# Altium schematic sheet Power.SchDoc
size A4; SheetNumber: 4; SheetTotal: 9
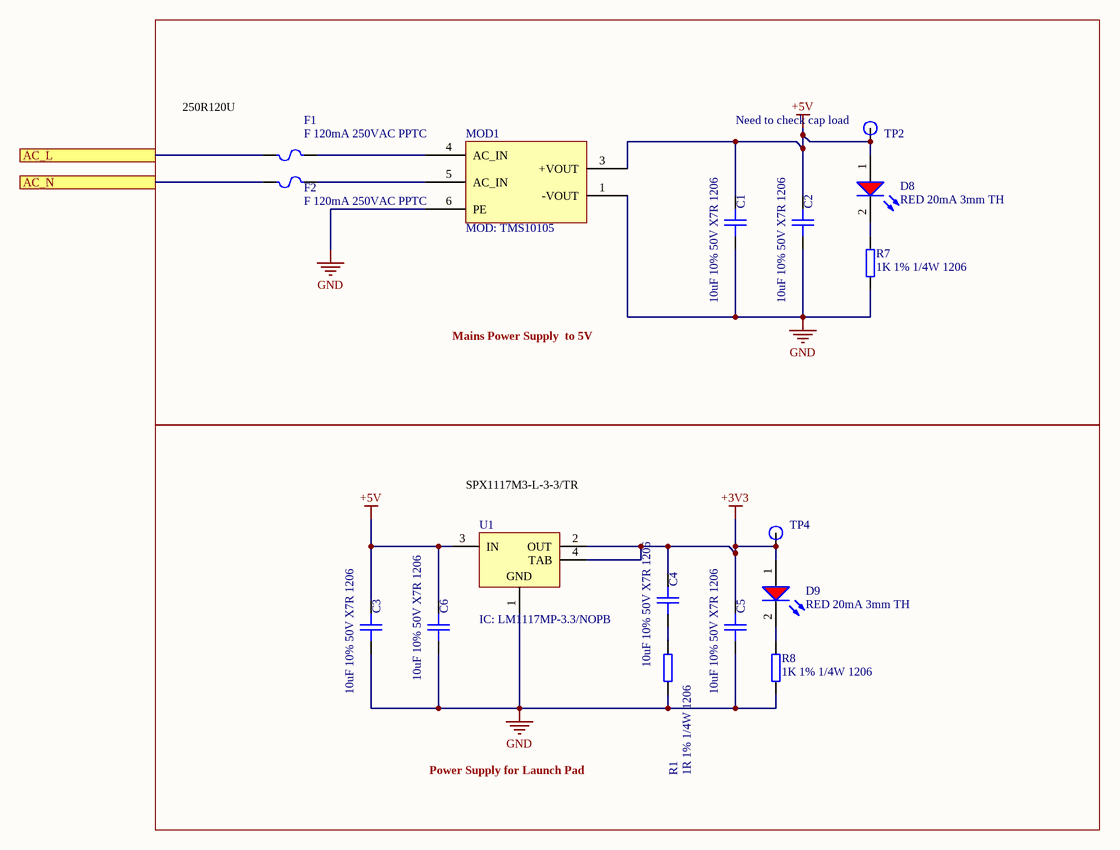
[diagram p0: Power.SchDoc]

## Parts
C1  10uF 10% 50V X7R 1206  [CAPC3216X18N]
C2  10uF 10% 50V X7R 1206  [CAPC3216X18N]
C3  10uF 10% 50V X7R 1206  [CAPC3216X18N]
C4  10uF 10% 50V X7R 1206  [CAPC3216X18N]
C5  10uF 10% 50V X7R 1206  [CAPC3216X18N]
C6  10uF 10% 50V X7R 1206  [CAPC3216X18N]
D8  RED 20mA 3mm TH  [WL-TMRC_D3.95H5.3]
D9  RED 20mA 3mm TH  [WL-TMRC_D3.95H5.3]
F1  F 120mA 250VAC PPTC  [New footprint 1]
F2  F 120mA 250VAC PPTC  [New footprint 1]
MOD1  MOD: TMS10105  [MOD: TMS10105-Footprint-1]
R1  1R 1% 1/4W 1206  [RESC3116X06N]
R7  1K 1% 1/4W 1206  [RESC3116X06N]
R8  1K 1% 1/4W 1206  [RESC3116X06N]
TP2  TestPoint  [Test Point-Footprint-1]  (value not drawn)
TP4  TestPoint  [Test Point-Footprint-1]  (value not drawn)
U1  IC: LM1117MP-3.3/NOPB  [DCY0004A_M]

## Blocks framed on the sheet
Power Supply for Launch Pad: C3-C6 D9 R1 R8 TP4 U1

## Ports
AC_L (see Control_Board_SCH[1A]), AC_N (see Control_Board_SCH[1A])

## Nets
+3V3: C4.2 C5.2 D9.1(A) TP4.1 U1.2(OUT) U1.4(TAB)
+5V: C1.2 C2.2 C3.2 C6.2 D8.1(A) MOD1.3(+VOUT) TP2.1 U1.3(IN)
GND: C1.1 C2.1 C3.1 C5.1 C6.1 MOD1.1(-VOUT) MOD1.6(PE) R1.1 R7.1 R8.1 U1.1(GND)
AC_L: F1.1 ; port AC_L
AC_N: F2.1 ; port AC_N
NetC4_1: C4.1 R1.2
NetD8_2: D8.2(K) R7.2
NetD9_2: D9.2(K) R8.2
NetF1_2: F1.2 MOD1.4(AC_IN)
NetF2_2: F2.2 MOD1.5(AC_IN)

## Notes on the sheet
- 250R120U
- (near TP2) Need to check cap load
- Mains Power Supply  to 5V
- SPX1117M3-L-3-3/TR

## Library data of the parts
C1-C6 = CMP-001-00049-1: Ceramic Capacitor, Multilayer, Ceramic, 50V, 10% +Tol, 10% -Tol, X7R, 15% TC, 10uF, Surface Mount, 1206; Manufacturer Part Number: C3216X7R1H106K160AC; Manufacturer: TDK; Manufacturer Lifecycle Status: PRODUCTION; Value: 10µF; ComponentLink3Description: https://datasheet.octopart.com:443/C3216X7R1H106K160AC-TDK-datasheet-159617022.pdf?src-supplier=TME; ComponentLink3URL: https://datasheet.octopart.com:443/C3216X7R1H106K160AC-TDK-datasheet-159617022.pdf?src-supplier=TME; China RoHS: Compliant; Case Code (Metric): 3216; ComponentLink2URL: https://datasheet.octopart.com:443/C3216X7R1H106K160AC-TDK-datasheet-182135025.pdf?src-supplier=TME; Mounting Technology: Surface Mount; Dielectric: X7R; Material: Ceramic; RoHS: Compliant; Introduction Date: 2018-03-29; Design Item ID: 10uF 10% 50V X7R 1206; Max Length: 3.5mm; ComponentLink4URL: https://datasheet.octopart.com:443/C3216X7R1H106K160AC-TDK-datasheet-151546523.pdf?src-supplier=ODG+(Origin+Data+Global); Length: 3.2mm; Height: 1.6mm; Harmonized Tariff Schedule (HTS) Code: 8532.24.00.20; Lifecycle Status: Production; ComponentLink1Description: https://datasheet.octopart.com:443/C3216X7R1H106K160AC-TDK-datasheet-175423548.pdf?src-supplier=TME; Width: 1.6mm; Min Length: 3.1mm; Min Operating Temperature: -55°C; Number of Terminals: 2; ComponentLink4Description: https://datasheet.octopart.com:443/C3216X7R1H106K160AC-TDK-datasheet-151546523.pdf?src-supplier=ODG+(Origin+Data+Global); Dielectric Material: Ceramic; Source: MasterLibrary_SCH.SchLib; Lead Free: Lead Free; Category: Ceramic Capacitors; ComponentLink5URL: https://datasheet.octopart.com/C3216X7R1H106K160AC-TDK-datasheet-41194876.pdf; ComponentLink5Description: https://datasheet.octopart.com/C3216X7R1H106K160AC-TDK-datasheet-41194876.pdf; Schedule B: 8532240020, 8532240020; Case/Package: 1206; Max Width: 1.9mm; Stock: 26276; Min Width: 1.5mm; Thickness: 1.6mm; ComponentLink1URL: https://datasheet.octopart.com:443/C3216X7R1H106K160AC-TDK-datasheet-175423548.pdf?src-supplier=TME; Pricing: 100=3,09, 250=2,81, 500=2,35, 1000=2,2, 2000=1,97 (DKK); Max Operating Temperature: 125°C; ComponentLink2Description: https://datasheet.octopart.com:443/C3216X7R1H106K160AC-TDK-datasheet-182135025.pdf?src-supplier=TME; Voltage Rating: 50V; REACH SVHC: Yes; Voltage Rating (DC): 50V; Export Control Classification Number (ECCN) Code: EAR99
D8 D9 = CMP-007-00005-2: LED RED DIFFUSED 3MM ROUND T/H; Manufacturer: Wurth Elektronik; Manufacturer Part Number: 151031SS06000; Lens Style: Circular, Diffused, Round; Peak Wavelength: 650nm; Dominant Wavelength: 640nm; Max Reverse Voltage (DC): 5V; Luminous Intensity: 35mcd; Forward Voltage: 2.2V; Forward Current: 100mA; Max Operating Temperature: 85°C; Length: 3mm; Category: LEDs; RoHS: Compliant; Lens Size: 3mm; Height: 5.3mm; Test Current: 20mA; Color: Red; Min Operating Temperature: -40°C; Packaging: Bulk; Case/Package: Radial; Mount: Through Hole; REACH SVHC: Unknown
F1 F2 = CMP-005-00003-1: Polymeric PTC Resettable Fuse 60V (250V Int) 120 mA Ih Through Hole Radial, Disc; Manufacturer Part Number: 250R120U; Manufacturer: Littelfuse; Approvals: TUV, cULus; Current Rating: 3A; Harmonized Tariff Schedule (HTS) Code: 8533.40.80.70; Length: 11mm; Max Voltage Rating (DC): 60V; Lead Pitch: 5.1mm; Lead Free: Lead Free; China RoHS: Compliant; Introduction Date: 2006-06-05; Max Operating Temperature: 85°C; Lifecycle Status: Production; Max Current Rating: 3A; Hold Current: 120mA; Category: PTC Resettable Fuses; Height: 11mm; Case/Package: Radial; Export Control Classification Number (ECCN) Code: EAR99
MOD1 = CMP-019-00012-2: AC-DC Regulated Power Supply Module, 1 Output, 10W, 5V Output Hybrid; Manufacturer: Traco Power; Max Output Current: 2A; Approvals: CB, CE, EN, IEC, UL, cUL; Max Output Voltage: 5.1V; Efficiency: 78%; Min Output Voltage: 4.9V; Nominal Input Voltage: 115V; Min Input Voltage: 85V; Number of Outputs: 1; Max Input Voltage: 264V; Min Operating Temperature: -25°C; Max Output Power: 10W; Number of Pins: 6; Height - Seated (Max): 24.5mm; Max Operating Temperature: 60°C; Output Current: 2A; Number of Terminals: 6; Length: 55mm; Category: Power Supply Modules; Output Voltage: 5V; Depth: 45mm; Lifecycle Status: Obsolete; Manufacturer Part Number: TMS10105; Output Power: 10W; Nominal Output Voltage: 5V; Current - Output 1: 2A; Number of Circuits: 1
R1 = CMP-009-00657-1: Res Thick Film 1206 1 Ohm 1% 0.25W(1/4W) ±100ppm/C Pad SMD T/R Automotive AEC-Q200; Manufacturer: Stackpole Electronics; Manufacturer Part Number: RMCF1206FT1R00; Temperature Coefficient: 100ppm/°C; Max Power Dissipation: 125mW; Working Voltage: 150V; Value: 1; ComponentLink29URL: https://datasheet.octopart.com:443/RMCF1206FT10K0-Stackpole-Electronics-datasheet-8324226.pdf?src-supplier=Future+Electronics; ComponentLink11URL: https://datasheet.octopart.com:443/RMCF0805FT10K0-Stackpole-Electronics-datasheet-8359789.pdf?src-supplier=Future+Electronics; ComponentLink1Description: https://datasheet.octopart.com:443/RMCF0805FT10K0-Stackpole-Electronics-datasheet-182148065.pdf?src-supplier=IHS; ComponentLink16URL: http://sigma.octopart.com:80/141158211/reach_statement/Stackpole-Electronics-RMCF0805FT10K0.pdf?src-supplier=Compliance+Statements; ComponentLink16Description: http://sigma.octopart.com:80/141158211/reach_statement/Stackpole-Electronics-RMCF0805FT10K0.pdf?src-supplier=Compliance+Statements; Max Operating Temperature: 155°C; ComponentLink27Description: https://datasheet.octopart.com:443/RMCF1206FT10K0-Stackpole-Electronics-datasheet-11547379.pdf?src-supplier=Future+Electronics; ComponentLink19URL: https://datasheet.octopart.com:443/RMCF1206FT10K0-Stackpole-Electronics-datasheet-141193804.pdf?src-supplier=Master+Electronics; Number of Terminals: 2; ComponentLink31URL: http://sigma.octopart.com:80/141158212/rohs_statement/Stackpole-Electronics-RMCF1206FT10K0.pdf?src-supplier=Compliance+Statements; ComponentLink32Description: http://sigma.octopart.com:80/141158211/reach_statement/Stackpole-Electronics-RMCF1206FT10K0.pdf?src-supplier=Compliance+Statements; ComponentLink20Description: https://datasheet.octopart.com:443/RMCF1206FT10K0-Stackpole-Electronics-datasheet-189104163.pdf?src-supplier=Master+Electronics; ComponentLink7URL: https://datasheet.octopart.com:443/RMCF0805FT10K0-Stackpole-Electronics-datasheet-10788263.pdf?src-supplier=Stackpole+Electronics; ComponentLink4Description: https://datasheet.octopart.com:443/RMCF0805FT10K0-Stackpole-Electronics-datasheet-12510902.pdf?src-supplier=Upverter; ComponentLink21URL: https://datasheet.octopart.com:443/RMCF1206FT10K0-Stackpole-Electronics-datasheet-116606903.pdf?src-supplier=Master+Electronics; ComponentLink27URL: https://datasheet.octopart.com:443/RMCF1206FT10K0-Stackpole-Electronics-datasheet-11547379.pdf?src-supplier=Future+Electronics; ComponentLink10URL: https://datasheet.octopart.com:443/RMCF0805FT10K0-Stackpole-Electronics-datasheet-11547379.pdf?src-supplier=Future+Electronics; ComponentLink8URL: https://datasheet.octopart.com:443/RMCF0805FT10K0-Stackpole-Electronics-datasheet-154799224.pdf?src-supplier=Master+Electronics; Stock: 3420000; Features: Automotive AEC-Q200; Lifecycle Status: Production; Tolerance: 1%; ComponentLink15Description: http://sigma.octopart.com:80/15940719/materials_sheet/Stackpole-Electronics-RMCF0805FT10K0.pdf?src-supplier=Compliance+Statements; ComponentLink12Description: https://datasheet.octopart.com:443/RMCF0805FT10K0-Stackpole-Electronics-datasheet-8324226.pdf?src-supplier=Future+Electronics; ComponentLink18Description: https://datasheet.octopart.com:443/RMCF1206FT10K0-Stackpole-Electronics-datasheet-182148065.pdf?src-supplier=IHS; ComponentLink9URL: https://datasheet.octopart.com:443/RMCF0805FT10K0-Stackpole-Electronics-datasheet-11546843.pdf?src-supplier=Arrow+Electronics; Schedule B: 8533210045, 8533210045; Pricing: 5000=0.00245, 10000=0.00241, 20000=0.00238, 40000=0.00234, 80000=0.0023 (USD); ComponentLink5URL: https://datasheet.octopart.com:443/RMCF0805FT10K0-Stackpole-Electronics-datasheet-141193804.pdf?src-supplier=Stackpole+Electronics; ComponentLink31Description: http://sigma.octopart.com:80/141158212/rohs_statement/Stackpole-Electronics-RMCF1206FT10K0.pdf?src-supplier=Compliance+Statements; Case/Package: 1206; ComponentLink24URL: https://datasheet.octopart.com:443/RMCF1206FT10K0-Stackpole-Electronics-datasheet-12534581.pdf?src-supplier=Stackpole+Electronics; ComponentLink13Description: https://datasheet.octopart.com:443/RMCF0805FT10K0-Stackpole-Electronics-datasheet-8088878.pdf?src-supplier=Future+Electronics; ComponentLink2Description: https://datasheet.octopart.com:443/RMCF0805FT10K0-Stackpole-Electronics-datasheet-12534581.pdf?src-supplier=Upverter; ComponentLink17URL: http://sigma.octopart.com:80/141158212/rohs_statement/Stackpole-Electronics-RMCF0805FT10K0.pdf?src-supplier=Compliance+Statements; Depth: 1.25mm; ComponentLink3URL: https://datasheet.octopart.com:443/RMCF0805FT10K0-Stackpole-Electronics-datasheet-28504820.pdf?src-supplier=Upverter; ComponentLink21Description: https://datasheet.octopart.com:443/RMCF1206FT10K0-Stackpole-Electronics-datasheet-116606903.pdf?src-supplier=Master+Electronics; ComponentLink32URL: http://sigma.octopart.com:80/141158211/reach_statement/Stackpole-Electronics-RMCF1206FT10K0.pdf?src-supplier=Compliance+Statements; ComponentLink4URL: https://datasheet.octopart.com:443/RMCF0805FT10K0-Stackpole-Electronics-datasheet-12510902.pdf?src-supplier=Upverter; ComponentLink26Description: https://datasheet.octopart.com:443/RMCF1206FT10K0-Stackpole-Electronics-datasheet-11546843.pdf?src-supplier=Arrow+Electronics; ComponentLink15URL: http://sigma.octopart.com:80/15940719/materials_sheet/Stackpole-Electronics-RMCF0805FT10K0.pdf?src-supplier=Compliance+Statements; ComponentLink18URL: https://datasheet.octopart.com:443/RMCF1206FT10K0-Stackpole-Electronics-datasheet-182148065.pdf?src-supplier=IHS; ComponentLink22URL: https://datasheet.octopart.com:443/RMCF1206FT10K0-Stackpole-Electronics-datasheet-62091608.pdf?src-supplier=Upverter; ComponentLink28URL: https://datasheet.octopart.com:443/RMCF1206FT10K0-Stackpole-Electronics-datasheet-8359789.pdf?src-supplier=Future+Electronics; Voltage Rating: 150V; ComponentLink29Description: https://datasheet.octopart.com:443/RMCF1206FT10K0-Stackpole-Electronics-datasheet-8324226.pdf?src-supplier=Future+Electronics; ComponentLink14URL: https://datasheet.octopart.com:443/RMCF0805FT10K0-Stackpole-Electronics-datasheet-5313682.pdf?src-supplier=Future+Electronics; Radiation Hardening: No; ComponentLink2URL: https://datasheet.octopart.com:443/RMCF0805FT10K0-Stackpole-Electronics-datasheet-12534581.pdf?src-supplier=Upverter; Packaging: Cut Tape (CT); Contact Plating: Tin; ComponentLink3Description: https://datasheet.octopart.com:443/RMCF0805FT10K0-Stackpole-Electronics-datasheet-28504820.pdf?src-supplier=Upverter; China RoHS: Non-Compliant; ComponentLink6Description: https://datasheet.octopart.com:443/RMCF0805FT10K0-Stackpole-Electronics-datasheet-62091608.pdf?src-supplier=Stackpole+Electronics; Source: MasterLibrary_SCH.SchLib; Power Rating: 125mW; ComponentLink19Description: https://datasheet.octopart.com:443/RMCF1206FT10K0-Stackpole-Electronics-datasheet-141193804.pdf?src-supplier=Master+Electronics; REACH SVHC: Yes; ComponentLink8Description: https://datasheet.octopart.com:443/RMCF0805FT10K0-Stackpole-Electronics-datasheet-154799224.pdf?src-supplier=Master+Electronics; ComponentLink22Description: https://datasheet.octopart.com:443/RMCF1206FT10K0-Stackpole-Electronics-datasheet-62091608.pdf?src-supplier=Upverter; ComponentLink12URL: https://datasheet.octopart.com:443/RMCF0805FT10K0-Stackpole-Electronics-datasheet-8324226.pdf?src-supplier=Future+Electronics; ComponentLink26URL: https://datasheet.octopart.com:443/RMCF1206FT10K0-Stackpole-Electronics-datasheet-11546843.pdf?src-supplier=Arrow+Electronics; ComponentLink7Description: https://datasheet.octopart.com:443/RMCF0805FT10K0-Stackpole-Electronics-datasheet-10788263.pdf?src-supplier=Stackpole+Electronics; Military Standard: Not; ComponentLink30URL: http://sigma.octopart.com:80/15940719/materials_sheet/Stackpole-Electronics-RMCF1206FT10K0.pdf?src-supplier=Compliance+Statements; ComponentLink20URL: https://datasheet.octopart.com:443/RMCF1206FT10K0-Stackpole-Electronics-datasheet-189104163.pdf?src-supplier=Master+Electronics; ComponentLink9Description: https://datasheet.octopart.com:443/RMCF0805FT10K0-Stackpole-Electronics-datasheet-11546843.pdf?src-supplier=Arrow+Electronics; ComponentLink5Description: https://datasheet.octopart.com:443/RMCF0805FT10K0-Stackpole-Electronics-datasheet-141193804.pdf?src-supplier=Stackpole+Electronics; Number of Terminations: 2; ComponentLink6URL: https://datasheet.octopart.com:443/RMCF0805FT10K0-Stackpole-Electronics-datasheet-62091608.pdf?src-supplier=Stackpole+Electronics; Min Operating Temperature: -55°C; ComponentLink24Description: https://datasheet.octopart.com:443/RMCF1206FT10K0-Stackpole-Electronics-datasheet-12534581.pdf?src-supplier=Stackpole+Electronics; ComponentLink11Description: https://datasheet.octopart.com:443/RMCF0805FT10K0-Stackpole-Electronics-datasheet-8359789.pdf?src-supplier=Future+Electronics; ComponentLink10Description: https://datasheet.octopart.com:443/RMCF0805FT10K0-Stackpole-Electronics-datasheet-11547379.pdf?src-supplier=Future+Electronics; Design Item ID: 1R 1% 1/4W 1206; ComponentLink25Description: https://datasheet.octopart.com:443/RMCF1206FT10K0-Stackpole-Electronics-datasheet-10788263.pdf?src-supplier=Stackpole+Electronics; Composition: Thick Film; Length: 2mm; Mounting Technology: Surface Mount; ComponentLink17Description: http://sigma.octopart.com:80/141158212/rohs_statement/Stackpole-Electronics-RMCF0805FT10K0.pdf?src-supplier=Compliance+Statements; ComponentLink28Description: https://datasheet.octopart.com:443/RMCF1206FT10K0-Stackpole-Electronics-datasheet-8359789.pdf?src-supplier=Future+Electronics; ComponentLink23URL: https://datasheet.octopart.com:443/RMCF1206FT10K0-Stackpole-Electronics-datasheet-28504820.pdf?src-supplier=Upverter; ComponentLink14Description: https://datasheet.octopart.com:443/RMCF0805FT10K0-Stackpole-Electronics-datasheet-5313682.pdf?src-supplier=Future+Electronics; Height: 500µm; Power Dissipation: 125mW; Width: 1.25mm; RoHS: Compliant; Lead Free: Lead Free; ComponentLink25URL: https://datasheet.octopart.com:443/RMCF1206FT10K0-Stackpole-Electronics-datasheet-10788263.pdf?src-supplier=Stackpole+Electronics; Case Code (Metric): 3216; ComponentLink23Description: https://datasheet.octopart.com:443/RMCF1206FT10K0-Stackpole-Electronics-datasheet-28504820.pdf?src-supplier=Upverter; ComponentLink30Description: http://sigma.octopart.com:80/15940719/materials_sheet/Stackpole-Electronics-RMCF1206FT10K0.pdf?src-supplier=Compliance+Statements; ComponentLink13URL: https://datasheet.octopart.com:443/RMCF0805FT10K0-Stackpole-Electronics-datasheet-8088878.pdf?src-supplier=Future+Electronics; ComponentLink1URL: https://datasheet.octopart.com:443/RMCF0805FT10K0-Stackpole-Electronics-datasheet-182148065.pdf?src-supplier=IHS; Category: Chip SMD Resistors
R7 R8 = CMP-009-00647-1: Res Thick Film 1206 1K Ohm 1% 0.25W(1/4W) ±100ppm/C Pad SMD T/R Automotive AEC-Q200; Manufacturer Part Number: RMCF1206FT1K00; Manufacturer: Stackpole Electronics; Power Rating: 125mW; Temperature Coefficient: 100ppm/°C; Voltage Rating: 150V; ComponentLink27URL: https://datasheet.octopart.com:443/RMCF1206FT10K0-Stackpole-Electronics-datasheet-11547379.pdf?src-supplier=Future+Electronics; RoHS: Compliant; ComponentLink5URL: https://datasheet.octopart.com:443/RMCF0805FT10K0-Stackpole-Electronics-datasheet-141193804.pdf?src-supplier=Stackpole+Electronics; ComponentLink5Description: https://datasheet.octopart.com:443/RMCF0805FT10K0-Stackpole-Electronics-datasheet-141193804.pdf?src-supplier=Stackpole+Electronics; ComponentLink3Description: https://datasheet.octopart.com:443/RMCF0805FT10K0-Stackpole-Electronics-datasheet-28504820.pdf?src-supplier=Upverter; Case Code (Metric): 3216; ComponentLink28Description: https://datasheet.octopart.com:443/RMCF1206FT10K0-Stackpole-Electronics-datasheet-8359789.pdf?src-supplier=Future+Electronics; Contact Plating: Tin; ComponentLink26URL: https://datasheet.octopart.com:443/RMCF1206FT10K0-Stackpole-Electronics-datasheet-11546843.pdf?src-supplier=Arrow+Electronics; Power Dissipation: 125mW; ComponentLink25URL: https://datasheet.octopart.com:443/RMCF1206FT10K0-Stackpole-Electronics-datasheet-10788263.pdf?src-supplier=Stackpole+Electronics; ComponentLink11URL: https://datasheet.octopart.com:443/RMCF0805FT10K0-Stackpole-Electronics-datasheet-8359789.pdf?src-supplier=Future+Electronics; ComponentLink9Description: https://datasheet.octopart.com:443/RMCF0805FT10K0-Stackpole-Electronics-datasheet-11546843.pdf?src-supplier=Arrow+Electronics; ComponentLink13URL: https://datasheet.octopart.com:443/RMCF0805FT10K0-Stackpole-Electronics-datasheet-8088878.pdf?src-supplier=Future+Electronics; China RoHS: Non-Compliant; Height: 500µm; ComponentLink20URL: https://datasheet.octopart.com:443/RMCF1206FT10K0-Stackpole-Electronics-datasheet-189104163.pdf?src-supplier=Master+Electronics; Composition: Thick Film; Case/Package: 1206; ComponentLink18URL: https://datasheet.octopart.com:443/RMCF1206FT10K0-Stackpole-Electronics-datasheet-182148065.pdf?src-supplier=IHS; ComponentLink4URL: https://datasheet.octopart.com:443/RMCF0805FT10K0-Stackpole-Electronics-datasheet-12510902.pdf?src-supplier=Upverter; ComponentLink32Description: http://sigma.octopart.com:80/141158211/reach_statement/Stackpole-Electronics-RMCF1206FT10K0.pdf?src-supplier=Compliance+Statements; ComponentLink6Description: https://datasheet.octopart.com:443/RMCF0805FT10K0-Stackpole-Electronics-datasheet-62091608.pdf?src-supplier=Stackpole+Electronics; ComponentLink31URL: http://sigma.octopart.com:80/141158212/rohs_statement/Stackpole-Electronics-RMCF1206FT10K0.pdf?src-supplier=Compliance+Statements; Schedule B: 8533210045, 8533210045; ComponentLink7Description: https://datasheet.octopart.com:443/RMCF0805FT10K0-Stackpole-Electronics-datasheet-10788263.pdf?src-supplier=Stackpole+Electronics; ComponentLink22Description: https://datasheet.octopart.com:443/RMCF1206FT10K0-Stackpole-Electronics-datasheet-62091608.pdf?src-supplier=Upverter; ComponentLink12URL: https://datasheet.octopart.com:443/RMCF0805FT10K0-Stackpole-Electronics-datasheet-8324226.pdf?src-supplier=Future+Electronics; Military Standard: Not; Max Operating Temperature: 155°C; Lifecycle Status: Production; ComponentLink29URL: https://datasheet.octopart.com:443/RMCF1206FT10K0-Stackpole-Electronics-datasheet-8324226.pdf?src-supplier=Future+Electronics; Design Item ID: 1K 1% 1/4W 1206; ComponentLink2URL: https://datasheet.octopart.com:443/RMCF0805FT10K0-Stackpole-Electronics-datasheet-12534581.pdf?src-supplier=Upverter; ComponentLink6URL: https://datasheet.octopart.com:443/RMCF0805FT10K0-Stackpole-Electronics-datasheet-62091608.pdf?src-supplier=Stackpole+Electronics; ComponentLink3URL: https://datasheet.octopart.com:443/RMCF0805FT10K0-Stackpole-Electronics-datasheet-28504820.pdf?src-supplier=Upverter; ComponentLink13Description: https://datasheet.octopart.com:443/RMCF0805FT10K0-Stackpole-Electronics-datasheet-8088878.pdf?src-supplier=Future+Electronics; Source: MasterLibrary_SCH.SchLib; Length: 2mm; ComponentLink2Description: https://datasheet.octopart.com:443/RMCF0805FT10K0-Stackpole-Electronics-datasheet-12534581.pdf?src-supplier=Upverter; Max Power Dissipation: 125mW; REACH SVHC: Yes; ComponentLink17URL: http://sigma.octopart.com:80/141158212/rohs_statement/Stackpole-Electronics-RMCF0805FT10K0.pdf?src-supplier=Compliance+Statements; ComponentLink15URL: http://sigma.octopart.com:80/15940719/materials_sheet/Stackpole-Electronics-RMCF0805FT10K0.pdf?src-supplier=Compliance+Statements; ComponentLink21Description: https://datasheet.octopart.com:443/RMCF1206FT10K0-Stackpole-Electronics-datasheet-116606903.pdf?src-supplier=Master+Electronics; ComponentLink26Description: https://datasheet.octopart.com:443/RMCF1206FT10K0-Stackpole-Electronics-datasheet-11546843.pdf?src-supplier=Arrow+Electronics; Radiation Hardening: No; ComponentLink10URL: https://datasheet.octopart.com:443/RMCF0805FT10K0-Stackpole-Electronics-datasheet-11547379.pdf?src-supplier=Future+Electronics; Stock: 3420000; Working Voltage: 150V; Pricing: 5000=0.00245, 10000=0.00241, 20000=0.00238, 40000=0.00234, 80000=0.0023 (USD); Mounting Technology: Surface Mount; ComponentLink22URL: https://datasheet.octopart.com:443/RMCF1206FT10K0-Stackpole-Electronics-datasheet-62091608.pdf?src-supplier=Upverter; Depth: 1.25mm; ComponentLink9URL: https://datasheet.octopart.com:443/RMCF0805FT10K0-Stackpole-Electronics-datasheet-11546843.pdf?src-supplier=Arrow+Electronics; ComponentLink11Description: https://datasheet.octopart.com:443/RMCF0805FT10K0-Stackpole-Electronics-datasheet-8359789.pdf?src-supplier=Future+Electronics; ComponentLink15Description: http://sigma.octopart.com:80/15940719/materials_sheet/Stackpole-Electronics-RMCF0805FT10K0.pdf?src-supplier=Compliance+Statements; ComponentLink16Description: http://sigma.octopart.com:80/141158211/reach_statement/Stackpole-Electronics-RMCF0805FT10K0.pdf?src-supplier=Compliance+Statements; ComponentLink17Description: http://sigma.octopart.com:80/141158212/rohs_statement/Stackpole-Electronics-RMCF0805FT10K0.pdf?src-supplier=Compliance+Statements; Min Operating Temperature: -55°C; ComponentLink10Description: https://datasheet.octopart.com:443/RMCF0805FT10K0-Stackpole-Electronics-datasheet-11547379.pdf?src-supplier=Future+Electronics; Width: 1.25mm; Number of Terminals: 2; ComponentLink19URL: https://datasheet.octopart.com:443/RMCF1206FT10K0-Stackpole-Electronics-datasheet-141193804.pdf?src-supplier=Master+Electronics; ComponentLink7URL: https://datasheet.octopart.com:443/RMCF0805FT10K0-Stackpole-Electronics-datasheet-10788263.pdf?src-supplier=Stackpole+Electronics; ComponentLink30Description: http://sigma.octopart.com:80/15940719/materials_sheet/Stackpole-Electronics-RMCF1206FT10K0.pdf?src-supplier=Compliance+Statements; ComponentLink29Description: https://datasheet.octopart.com:443/RMCF1206FT10K0-Stackpole-Electronics-datasheet-8324226.pdf?src-supplier=Future+Electronics; Lead Free: Lead Free; ComponentLink23URL: https://datasheet.octopart.com:443/RMCF1206FT10K0-Stackpole-Electronics-datasheet-28504820.pdf?src-supplier=Upverter; ComponentLink24URL: https://datasheet.octopart.com:443/RMCF1206FT10K0-Stackpole-Electronics-datasheet-12534581.pdf?src-supplier=Stackpole+Electronics; ComponentLink32URL: http://sigma.octopart.com:80/141158211/reach_statement/Stackpole-Electronics-RMCF1206FT10K0.pdf?src-supplier=Compliance+Statements; ComponentLink21URL: https://datasheet.octopart.com:443/RMCF1206FT10K0-Stackpole-Electronics-datasheet-116606903.pdf?src-supplier=Master+Electronics; ComponentLink8URL: https://datasheet.octopart.com:443/RMCF0805FT10K0-Stackpole-Electronics-datasheet-154799224.pdf?src-supplier=Master+Electronics; ComponentLink14Description: https://datasheet.octopart.com:443/RMCF0805FT10K0-Stackpole-Electronics-datasheet-5313682.pdf?src-supplier=Future+Electronics; ComponentLink31Description: http://sigma.octopart.com:80/141158212/rohs_statement/Stackpole-Electronics-RMCF1206FT10K0.pdf?src-supplier=Compliance+Statements; ComponentLink18Description: https://datasheet.octopart.com:443/RMCF1206FT10K0-Stackpole-Electronics-datasheet-182148065.pdf?src-supplier=IHS; ComponentLink12Description: https://datasheet.octopart.com:443/RMCF0805FT10K0-Stackpole-Electronics-datasheet-8324226.pdf?src-supplier=Future+Electronics; ComponentLink23Description: https://datasheet.octopart.com:443/RMCF1206FT10K0-Stackpole-Electronics-datasheet-28504820.pdf?src-supplier=Upverter; ComponentLink1URL: https://datasheet.octopart.com:443/RMCF0805FT10K0-Stackpole-Electronics-datasheet-182148065.pdf?src-supplier=IHS; Packaging: Cut Tape (CT); Value: 1k; ComponentLink25Description: https://datasheet.octopart.com:443/RMCF1206FT10K0-Stackpole-Electronics-datasheet-10788263.pdf?src-supplier=Stackpole+Electronics; Features: Automotive AEC-Q200; ComponentLink20Description: https://datasheet.octopart.com:443/RMCF1206FT10K0-Stackpole-Electronics-datasheet-189104163.pdf?src-supplier=Master+Electronics; ComponentLink28URL: https://datasheet.octopart.com:443/RMCF1206FT10K0-Stackpole-Electronics-datasheet-8359789.pdf?src-supplier=Future+Electronics; ComponentLink14URL: https://datasheet.octopart.com:443/RMCF0805FT10K0-Stackpole-Electronics-datasheet-5313682.pdf?src-supplier=Future+Electronics; Number of Terminations: 2; Category: Chip SMD Resistors; ComponentLink16URL: http://sigma.octopart.com:80/141158211/reach_statement/Stackpole-Electronics-RMCF0805FT10K0.pdf?src-supplier=Compliance+Statements; ComponentLink30URL: http://sigma.octopart.com:80/15940719/materials_sheet/Stackpole-Electronics-RMCF1206FT10K0.pdf?src-supplier=Compliance+Statements; ComponentLink24Description: https://datasheet.octopart.com:443/RMCF1206FT10K0-Stackpole-Electronics-datasheet-12534581.pdf?src-supplier=Stackpole+Electronics; Tolerance: 1%; ComponentLink4Description: https://datasheet.octopart.com:443/RMCF0805FT10K0-Stackpole-Electronics-datasheet-12510902.pdf?src-supplier=Upverter; ComponentLink8Description: https://datasheet.octopart.com:443/RMCF0805FT10K0-Stackpole-Electronics-datasheet-154799224.pdf?src-supplier=Master+Electronics; ComponentLink19Description: https://datasheet.octopart.com:443/RMCF1206FT10K0-Stackpole-Electronics-datasheet-141193804.pdf?src-supplier=Master+Electronics; ComponentLink27Description: https://datasheet.octopart.com:443/RMCF1206FT10K0-Stackpole-Electronics-datasheet-11547379.pdf?src-supplier=Future+Electronics; ComponentLink1Description: https://datasheet.octopart.com:443/RMCF0805FT10K0-Stackpole-Electronics-datasheet-182148065.pdf?src-supplier=IHS
TP2 TP4 = CMP-002-00584-1
U1 = CMP-302-000001-1: Texas Instruments LM1117MP-3.3/NOPB. Ldo Voltage Regulator, 3.3V, 0.8A, SOT-223-4, Full Reel; Manufacturer Lifecycle Status: ACTIVE; Manufacturer Order Number: LDO Voltage Regulators; Max Output Current: 800mA; Max Supply Voltage: 10V; Number of Channels: 1; Min Input Voltage: 2.6V; Min Supply Voltage: 4.75V; Max Input Voltage: 15V; Lead Free: Lead Free; Manufacturer: SOT-223; Mount: Surface Mount; Manufacturer Part Number: LM1117MP-3.3/NOPB; Package Reference: Tin; Lifecycle Status: Production; Height: 1.8mm; Min Operating Temperature: 0°C; Max Operating Temperature: 125°C; Min Current Limit: 800mA; Source: 800mA; Length: 6.5mm; Nominal Output Voltage: 3.3V; Number of Outputs: 1; Parameter 6: Texas Instruments